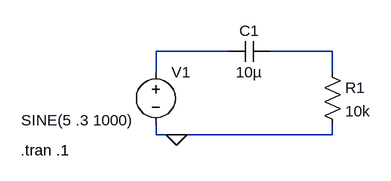
[diagram p0: schematic High Pass Filter.asc]
High Pass Filter.asc, the LTspice schematic file:
Version 4
SHEET 1 1056 680
WIRE 96 64 -16 64
WIRE 256 64 160 64
WIRE -16 96 -16 64
WIRE 256 96 256 64
WIRE -16 192 -16 176
WIRE 16 192 -16 192
WIRE 256 192 256 176
WIRE 256 192 16 192
FLAG 16 192 0
SYMBOL voltage -16 80 R0
WINDOW 3 -207 90 Left 2
WINDOW 123 0 0 Left 0
WINDOW 39 0 0 Left 0
SYMATTR InstName V1
SYMATTR Value SINE(5 .3 1000)
SYMBOL res 240 80 R0
SYMATTR InstName R1
SYMATTR Value 10k
SYMBOL cap 96 80 R270
WINDOW 0 32 32 VTop 2
WINDOW 3 0 32 VBottom 2
SYMATTR InstName C1
SYMATTR Value 10µ
TEXT -224 216 Left 2 !.tran .1

The netlist it stands for:
* High Pass Filter.asc
V1 N001 0 SINE(5 .3 1000)
R1 N002 0 10k
C1 N001 N002 10µ
.tran .1
.backanno
.end